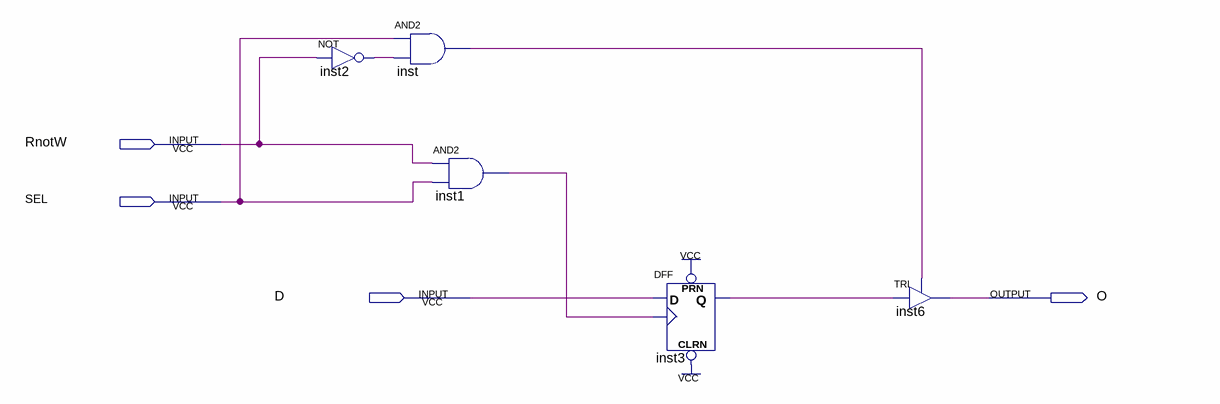
[diagram p0: schematic sheet]
// Quartus schematic CelulaDeMemoria.bdf as structural Verilog: 5 symbols, 4 pins
module CelulaDeMemoria (
  input  RnotW,
  input  SEL,
  input  D,
  output O
);

  wire inst1_out, inst2_out, inst3_q, inst_out;

  not inst2 (inst2_out, RnotW);
  and inst (inst_out, SEL, inst2_out);
  and inst1 (inst1_out, RnotW, SEL);
  DFF inst3 (.CLRN(1'b1), .CLK(inst1_out), .D(D), .PRN(1'b1), .Q(inst3_q));
  TRI inst6 (.IN(inst3_q), .OE(inst_out), .OUT(O));
endmodule
